# Altium schematic sheet P18 Level Switch.SchDoc
size 420 x 297 mm
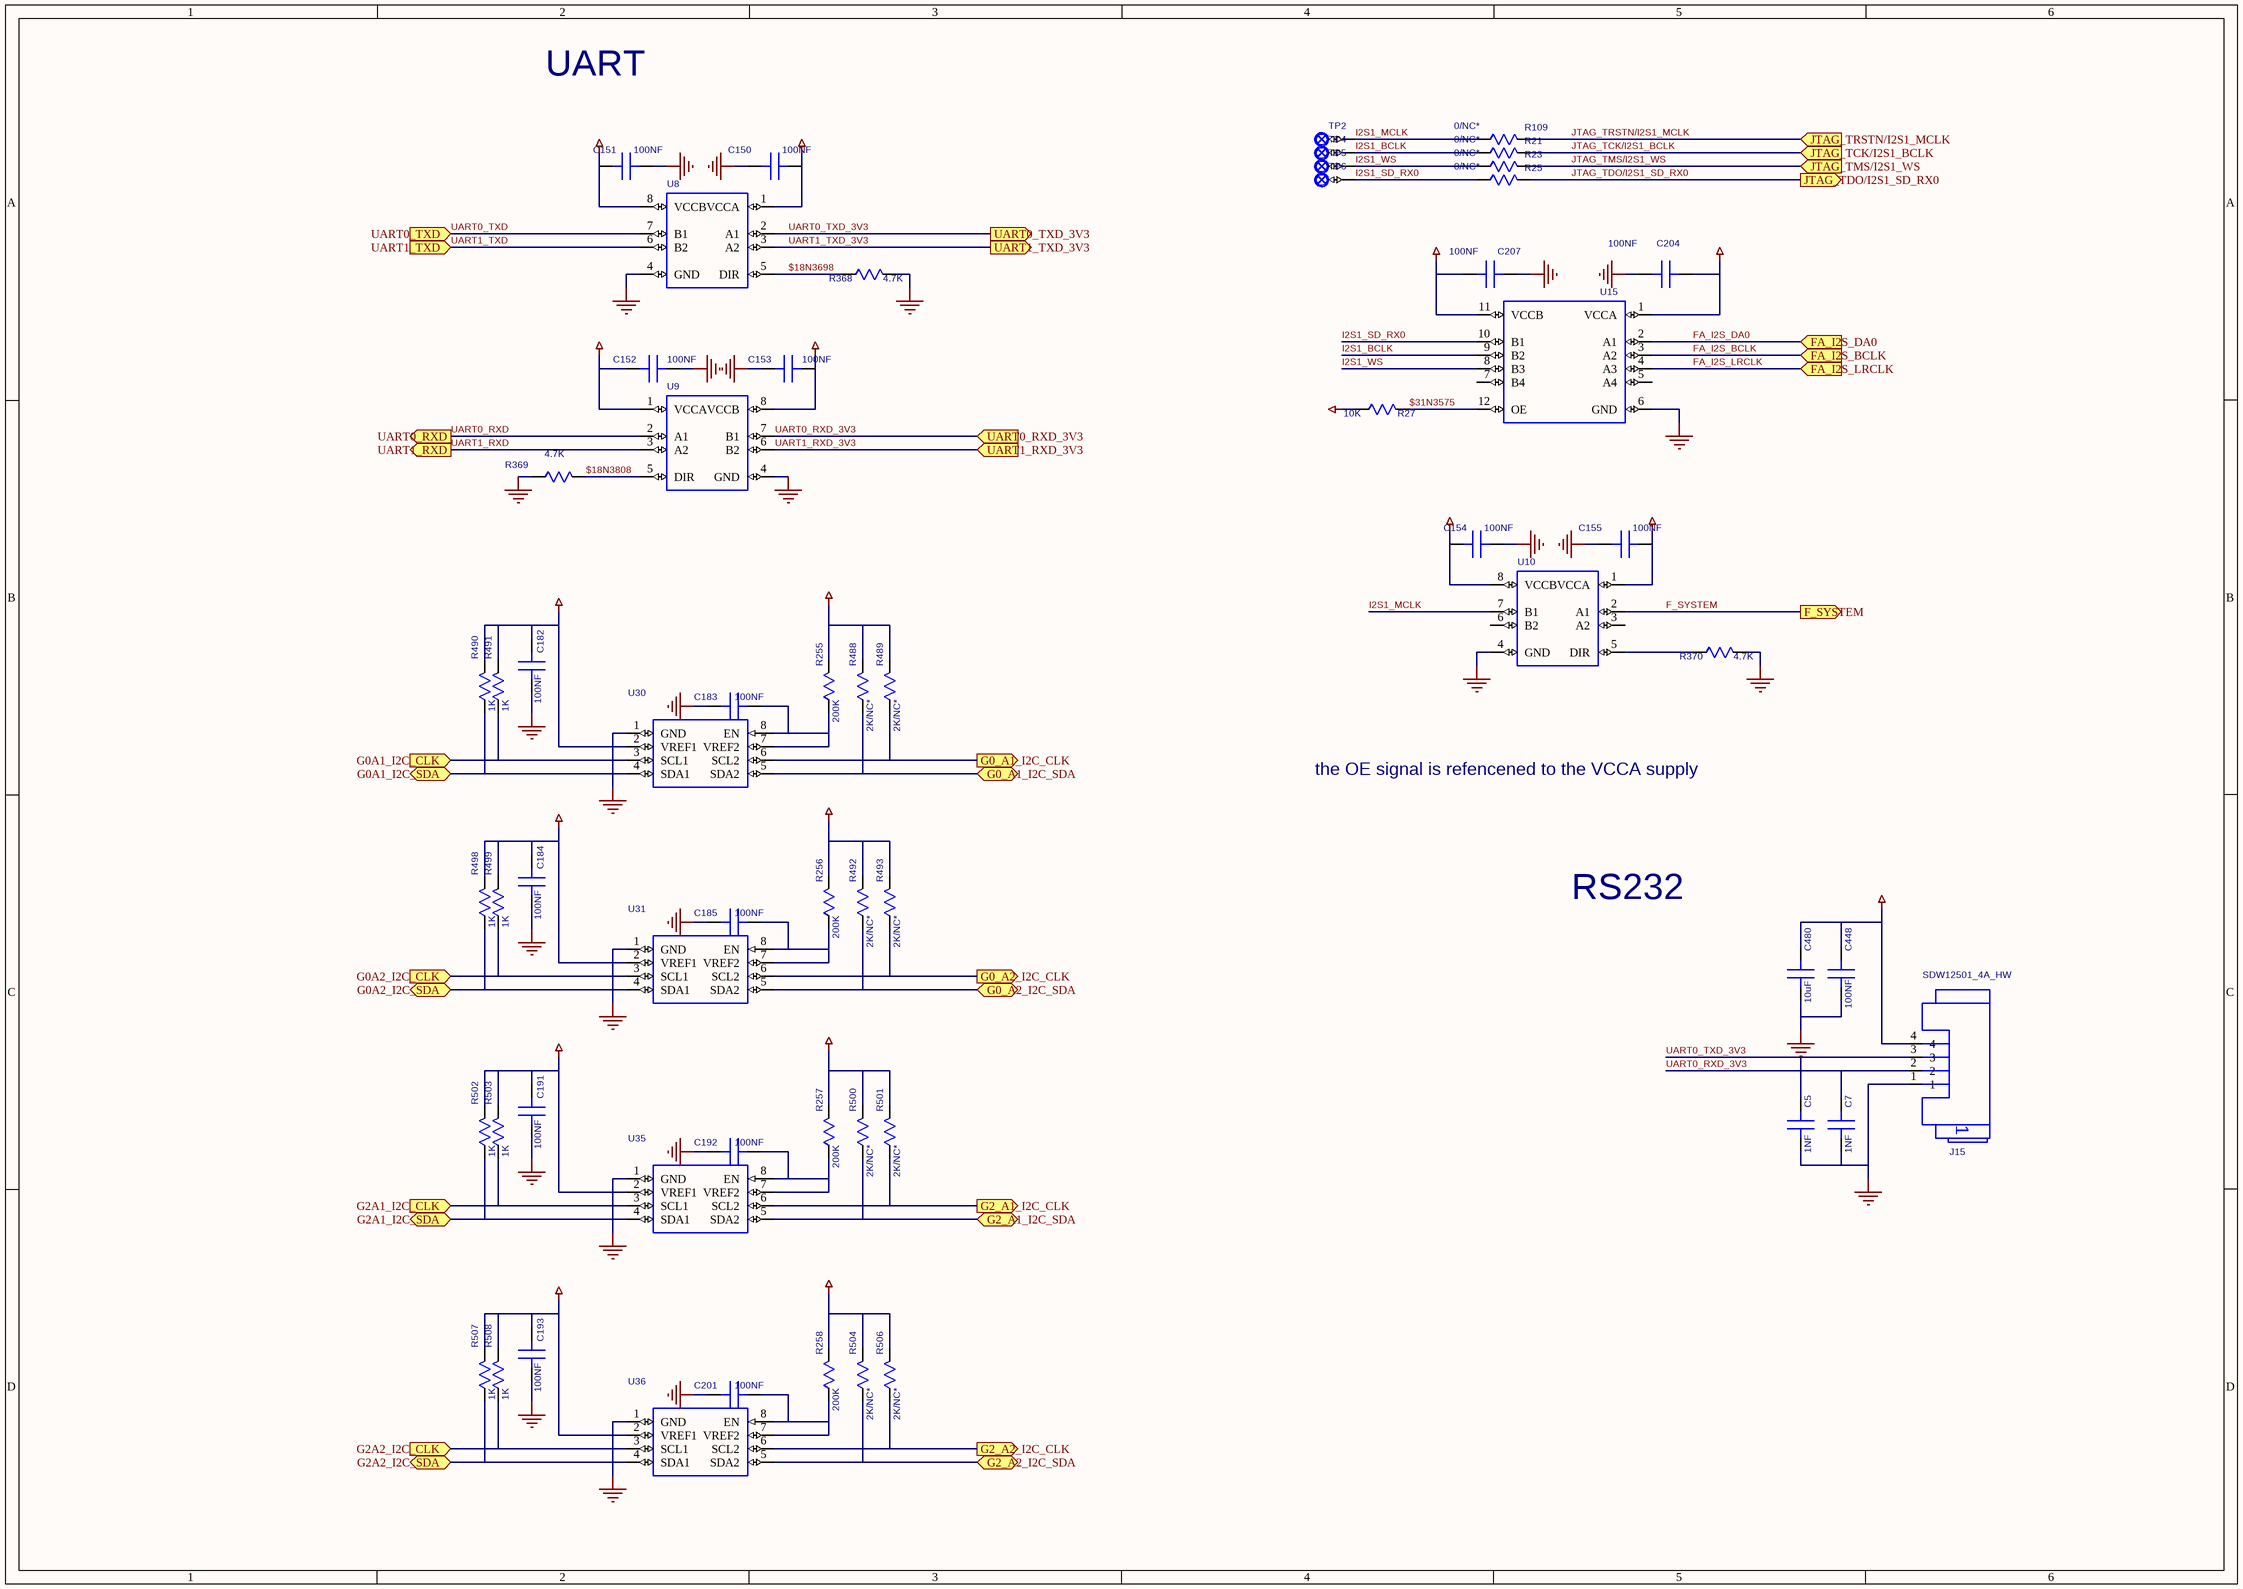
[diagram p0: P18 Level Switch.SchDoc]

## Parts
C5  1NF  [SC0402]
C7  1NF  [SC0402]
C150  100NF  [SC0402]
C151  100NF  [SC0402]
C152  100NF  [SC0402]
C153  100NF  [SC0402]
C154  100NF  [SC0402]
C155  100NF  [SC0402]
C182  100NF  [SC0402]
C183  100NF  [SC0402]
C184  100NF  [SC0402]
C185  100NF  [SC0402]
C191  100NF  [SC0402]
C192  100NF  [SC0402]
C193  100NF  [SC0402]
C201  100NF  [SC0402]
C204  100NF  [SC0402]
C207  100NF  [SC0402]
C448  100NF  [SC0402]
C480  10uF  [SC0603]
J15  DEVICE: SDW12501_4A_HW  [4PIN-254]  (hidden comment: WBC1X41)
R21  0/NC*  [SR0402]
R23  0/NC*  [SR0402]
R25  0/NC*  [SR0402]
R27  10K  [SR0402]
R109  0/NC*  [SR0402]
R255  200K  [SR0402]
R256  200K  [SR0402]
R257  200K  [SR0402]
R258  200K  [SR0402]
R368  4.7K  [SR0402]
R369  4.7K  [SR0402]
R370  4.7K  [SR0402]
R488  2K/NC*  [SR0402]
R489  2K/NC*  [SR0402]
R490  1K  [SR0402]
R491  1K  [SR0402]
R492  2K/NC*  [SR0402]
R493  2K/NC*  [SR0402]
R498  1K  [SR0402]
R499  1K  [SR0402]
R500  2K/NC*  [SR0402]
R501  2K/NC*  [SR0402]
R502  1K  [SR0402]
R503  1K  [SR0402]
R504  2K/NC*  [SR0402]
R506  2K/NC*  [SR0402]
R507  1K  [SR0402]
R508  1K  [SR0402]
TP2  TESTPOINT  [TP24-SMD]  (value not drawn)
TP4  TESTPOINT  [TP24-SMD]  (value not drawn)
TP5  TESTPOINT  [TP24-SMD]  (value not drawn)
TP6  TESTPOINT  [TP24-SMD]  (value not drawn)
U8  SN74AVCH2T45  [SOP8-20-91]  (value not drawn)
U9  SN74AVCH2T45  [SOP8-20-91]  (value not drawn)
U10  SN74AVCH2T45  [SOP8-20-91]  (value not drawn)
U15  TXB0304  [MLF12A-040-0202L]  (value not drawn)
U30  PCA9306DCTT  [SOP8-20-91]  (value not drawn)
U31  PCA9306DCTT  [SOP8-20-91]  (value not drawn)
U35  PCA9306DCTT  [SOP8-20-91]  (value not drawn)
U36  PCA9306DCTT  [SOP8-20-91]  (value not drawn)

## Ports
F_SYSTEM, FA_I2S_BCLK, FA_I2S_DA0, FA_I2S_LRCLK, G0_A1_I2C_CLK, G0_A1_I2C_SDA, G0_A2_I2C_CLK, G0_A2_I2C_SDA, G0A1_I2C_CLK, G0A1_I2C_SDA, G0A2_I2C_CLK, G0A2_I2C_SDA, G2_A1_I2C_CLK, G2_A1_I2C_SDA, G2_A2_I2C_CLK, G2_A2_I2C_SDA, G2A1_I2C_CLK, G2A1_I2C_SDA, G2A2_I2C_CLK, G2A2_I2C_SDA, JTAG_TCK/I2S1_BCLK, JTAG_TDO/I2S1_SD_RX0, JTAG_TMS/I2S1_WS, JTAG_TRSTN/I2S1_MCLK, UART0_RXD, UART0_RXD_3V3, UART0_TXD, UART0_TXD_3V3, UART1_RXD, UART1_RXD_3V3, UART1_TXD, UART1_TXD_3V3

## Nets
1V8: C151.1(A) C152.1(A) C154.1(A) C182.1(A) C184.1(A) C191.1(A) C193.1(A) C207.1(A) R490.1(A) R491.1(A) R498.1(A) R499.1(A) R502.1(A) R503.1(A) R507.1(A) R508.1(A) U8.8(VCCB) U9.1(VCCA) U10.8(VCCB) U15.11(VCCB) U30.2(VREF1) U31.2(VREF1) U35.2(VREF1) U36.2(VREF1)
3V3: C150.1(A) C153.1(A) C155.1(A) C204.1(A) C448.1(A) C480.1(A) J15.4 R27.2(B) R255.1(A) R256.1(A) R257.1(A) R258.1(A) R488.1(A) R489.1(A) R492.1(A) R493.1(A) R500.1(A) R501.1(A) R504.1(A) R506.1(A) U8.1(VCCA) U9.8(VCCB) U10.1(VCCA) U15.1(VCCA)
GND: C5.2(B) C7.2(B) C150.2(B) C151.2(B) C152.2(B) C153.2(B) C154.2(B) C155.2(B) C182.2(B) C183.2(B) C184.2(B) C185.2(B) C191.2(B) C192.2(B) C193.2(B) C201.2(B) C204.2(B) C207.2(B) C448.2(B) C480.2(B) J15.1 R368.2(B) R369.1(A) R370.2(B) U8.4(GND) U9.4(GND) U10.4(GND) U15.6(GND) U30.1(GND) U31.1(GND) U35.1(GND) U36.1(GND)
$18N3698: R368.1(A) U8.5(DIR)
$18N3808: R369.2(B) U9.5(DIR)
$31N3575: R27.1(A) U15.12(OE)
F_SYSTEM: U10.2(A1) ; port F_SYSTEM
FA_I2S_BCLK: U15.3(A2) ; port FA_I2S_BCLK
FA_I2S_DA0: U15.2(A1) ; port FA_I2S_DA0
FA_I2S_LRCLK: U15.4(A3) ; port FA_I2S_LRCLK
G0_A1_I2C_CLK: R489.2(B) U30.6(SCL2) ; port G0_A1_I2C_CLK
G0_A1_I2C_SDA: R488.2(B) U30.5(SDA2) ; port G0_A1_I2C_SDA
G0_A2_I2C_CLK: R493.2(B) U31.6(SCL2) ; port G0_A2_I2C_CLK
G0_A2_I2C_SDA: R492.2(B) U31.5(SDA2) ; port G0_A2_I2C_SDA
G0A1_I2C_CLK: R491.2(B) U30.3(SCL1) ; port G0A1_I2C_CLK
G0A1_I2C_SDA: R490.2(B) U30.4(SDA1) ; port G0A1_I2C_SDA
G0A2_I2C_CLK: R499.2(B) U31.3(SCL1) ; port G0A2_I2C_CLK
G0A2_I2C_SDA: R498.2(B) U31.4(SDA1) ; port G0A2_I2C_SDA
G2_A1_I2C_CLK: R501.2(B) U35.6(SCL2) ; port G2_A1_I2C_CLK
G2_A1_I2C_SDA: R500.2(B) U35.5(SDA2) ; port G2_A1_I2C_SDA
G2_A2_I2C_CLK: R506.2(B) U36.6(SCL2) ; port G2_A2_I2C_CLK
G2_A2_I2C_SDA: R504.2(B) U36.5(SDA2) ; port G2_A2_I2C_SDA
G2A1_I2C_CLK: R503.2(B) U35.3(SCL1) ; port G2A1_I2C_CLK
G2A1_I2C_SDA: R502.2(B) U35.4(SDA1) ; port G2A1_I2C_SDA
G2A2_I2C_CLK: R508.2(B) U36.3(SCL1) ; port G2A2_I2C_CLK
G2A2_I2C_SDA: R507.2(B) U36.4(SDA1) ; port G2A2_I2C_SDA
I2S1_BCLK: R21.2(B) TP4.1 U15.9(B2)
I2S1_MCLK: R109.2(B) TP2.1 U10.7(B1)
I2S1_SD_RX0: R25.2(B) TP6.1 U15.10(B1)
I2S1_WS: R23.2(B) TP5.1 U15.8(B3)
JTAG_TCK/I2S1_BCLK: R21.1(A) ; port JTAG_TCK/I2S1_BCLK
JTAG_TDO/I2S1_SD_RX0: R25.1(A) ; port JTAG_TDO/I2S1_SD_RX0
JTAG_TMS/I2S1_WS: R23.1(A) ; port JTAG_TMS/I2S1_WS
JTAG_TRSTN/I2S1_MCLK: R109.1(A) ; port JTAG_TRSTN/I2S1_MCLK
UART0_RXD: U9.2(A1) ; port UART0_RXD
UART0_RXD_3V3: C7.1(A) J15.2 U9.7(B1) ; port UART0_RXD_3V3
UART0_TXD: U8.7(B1) ; port UART0_TXD
UART0_TXD_3V3: C5.1(A) J15.3 U8.2(A1) ; port UART0_TXD_3V3
UART1_RXD: U9.3(A2) ; port UART1_RXD
UART1_RXD_3V3: U9.6(B2) ; port UART1_RXD_3V3
UART1_TXD: U8.6(B2) ; port UART1_TXD
UART1_TXD_3V3: U8.3(A2) ; port UART1_TXD_3V3
NetC183_1: C183.1(A) R255.2(B) U30.7(VREF2) U30.8(EN)
NetC185_1: C185.1(A) R256.2(B) U31.7(VREF2) U31.8(EN)
NetC192_1: C192.1(A) R257.2(B) U35.7(VREF2) U35.8(EN)
NetC201_1: C201.1(A) R258.2(B) U36.7(VREF2) U36.8(EN)
NetR370_1: R370.1(A) U10.5(DIR)

Not connected (* = marked no-connect by the designer): U10 3(A2) 6(B2); U15 5(A4) 7(B4)

## Notes on the sheet
- UART
- the OE signal is refencened to the VCCA supply
- RS232

## Library data of the parts
C5 = C_0: PARTS: 1; OriginalSymbolOrigin: (0,30); DEVICE: 04025C102KAT2A; LEVEL: STD; PINSWAP: (A,B); %208%%161%%192%%224%%195%%251%%179%%198%: SMD陶瓷电容; COMPONENT_HIGH_MAX: 0.56MM; %182%%238%%182%%168%%185%%164%%215%%247%%181%%231%%209%%185%(V): 50; %195%%232%%202%%246%: SMD陶瓷电容-50V-1NF-+/-10%-X7R-0402-BT; CODE: 8070531; PKG_TYPE: SC0402
C7 = C_0: PARTS: 1; OriginalSymbolOrigin: (0,30); DEVICE: 04025C102KAT2A; LEVEL: STD; PINSWAP: (A,B); CODE: 8070531; %195%%232%%202%%246%: SMD陶瓷电容-50V-1NF-+/-10%-X7R-0402-BT; %182%%238%%182%%168%%185%%164%%215%%247%%181%%231%%209%%185%(V): 50; COMPONENT_HIGH_MAX: 0.56MM; %208%%161%%192%%224%%195%%251%%179%%198%: SMD陶瓷电容; PKG_TYPE: SC0402
C150 C152 C153 C155 C204 = C: PARTS: 1; OriginalSymbolOrigin: (0,0); DEVICE: RMEMK105BJ104KV_FR; LEVEL: STD; PINSWAP: (A,B); %208%%161%%192%%224%%195%%251%%179%%198%: SMD陶瓷电容; COMPONENT_HIGH_MAX: 0.55MM; %182%%238%%182%%168%%185%%164%%215%%247%%181%%231%%209%%185%(V): 16; %195%%232%%202%%246%: SMD陶瓷电容-16V-100nF-+/-10%-X7R-0402-BT; CODE: 8070614; PKG_TYPE: SC0402
C151 C154 C207 = C: PARTS: 1; OriginalSymbolOrigin: (0,0); DEVICE: RMEMK105BJ104KV_FR; LEVEL: STD; PINSWAP: (A,B); CODE: 8070614; %195%%232%%202%%246%: SMD陶瓷电容-16V-100nF-+/-10%-X7R-0402-BT; %182%%238%%182%%168%%185%%164%%215%%247%%181%%231%%209%%185%(V): 16; COMPONENT_HIGH_MAX: 0.55MM; %208%%161%%192%%224%%195%%251%%179%%198%: SMD陶瓷电容; PKG_TYPE: SC0402
C182-C185 C191-C193 C201 = C: PARTS: 1; OriginalSymbolOrigin: (0,0); DEVICE: RMEMK105BJ104KV_FR; LEVEL: STD; PINSWAP: (A,B); COMPONENT_HIGH_MAX: 0.55MM; %182%%238%%182%%168%%185%%164%%215%%247%%181%%231%%209%%185%(V): 16; CODE: 8070614; %195%%232%%202%%246%: SMD陶瓷电容-16V-100NF-+/-10%-X7R-0402-BT; %208%%161%%192%%224%%195%%251%%179%%198%: SMD陶瓷电容; PKG_TYPE: SC0402
C448 = C_0_Dup1: PARTS: 1; PINSWAP: (A,B); LEVEL: STD; DEVICE: RMEMK105BJ104KV_FR; OriginalSymbolOrigin: (0,30); %208%%161%%192%%224%%195%%251%%179%%198%: SMD陶瓷电容; COMPONENT_HIGH_MAX: 0.55MM; %182%%238%%182%%168%%185%%164%%215%%247%%181%%231%%209%%185%(V): 16; %195%%232%%202%%246%: SMD陶瓷电容-16V-100NF-+/-10%-X7R-0402-BT; CODE: 8070614; PKG_TYPE: SC0402
C480 = C_0_Dup1: PARTS: 1; PINSWAP: (A,B); LEVEL: STD; DEVICE: C1608X5R0J106MT0A0E; OriginalSymbolOrigin: (0,30); %208%%161%%192%%224%%195%%251%%179%%198%: SMD陶瓷电容; COMPONENT_HIGH_MAX: 0.9MM; %182%%238%%182%%168%%185%%164%%215%%247%%181%%231%%209%%185%(V): 6.3; %195%%232%%202%%246%: SMD陶瓷电容-6.3V-10000NF-+/-20%-X5R-0603-BT,TS16949; CODE: 8070649; PKG_TYPE: SC0603
J15 = WBC1X41_0: PARTS: 1; OriginalSymbolOrigin: (10,130); CODE: 14100167; PKG_TYPE: WBC0104-49T; LEVEL: STD; %195%%232%%202%%246%: 普通插座-4PIN-单排-直式-1.25MM-2MM-THT-1A; COMPONENT_HIGH_MAX: 4.2MM; %208%%161%%192%%224%%195%%251%%179%%198%: 普通插座
R21 = R_Dup1: PARTS: 1; OriginalSymbolOrigin: (0,0); PINSWAP: (A,B); DEVICE: RC0402JR_070R; LEVEL: STD; VARIANT_ID: $10I3470; %208%%161%%192%%224%%195%%251%%179%%198%: 片式厚膜电阻器; %195%%232%%202%%246%: 片式厚膜电阻器-0.0625W-0ohm-< 50mohm-0402-1A-BT; CODE: 7090800; COMPONENT_HIGH_MAX: 0.4MM; PKG_TYPE: SR0402
R23 = R_Dup1: PARTS: 1; OriginalSymbolOrigin: (0,0); PINSWAP: (A,B); DEVICE: RC0402JR_070R; LEVEL: STD; VARIANT_ID: $10I3506; COMPONENT_HIGH_MAX: 0.4MM; CODE: 7090800; %195%%232%%202%%246%: 片式厚膜电阻器-0.0625W-0ohm-< 50mohm-0402-1A-BT; %208%%161%%192%%224%%195%%251%%179%%198%: 片式厚膜电阻器; PKG_TYPE: SR0402
R25 = R_Dup1: PARTS: 1; OriginalSymbolOrigin: (0,0); PINSWAP: (A,B); DEVICE: RC0402JR_070R; LEVEL: STD; COMPONENT_HIGH_MAX: 0.4MM; CODE: 7090800; %195%%232%%202%%246%: 片式厚膜电阻器-0.0625W-0ohm-< 50mohm-0402-1A-BT; %208%%161%%192%%224%%195%%251%%179%%198%: 片式厚膜电阻器; VARIANT_ID: $10I3539; PKG_TYPE: SR0402
R27 = R_Dup1: PARTS: 1; OriginalSymbolOrigin: (0,0); PINSWAP: (A,B); DEVICE: RC_02W103JT; LEVEL: STD; CODE: 7090815; %195%%232%%202%%246%: 片式厚膜电阻器-0.0625W-10000ohm-+/-5%-0402-BT; %182%%238%%182%%168%%185%%166%%194%%202%(W): 0.06; %215%%232%%214%%181%%212%%202%%208%%237%%198%%171%%178%%238%: +/-5%; COMPONENT_HIGH_MAX: 0.4MM; %208%%161%%192%%224%%195%%251%%179%%198%: 片式厚膜电阻器; PKG_TYPE: SR0402
R109 = R_Dup1: PARTS: 1; OriginalSymbolOrigin: (0,0); PINSWAP: (A,B); DEVICE: RC0402JR_070R; LEVEL: STD; VARIANT_ID: $10I3071; COMPONENT_HIGH_MAX: 0.4MM; CODE: 7090800; %195%%232%%202%%246%: 片式厚膜电阻器-0.0625W-0ohm-< 50mohm-0402-1A-BT; %208%%161%%192%%224%%195%%251%%179%%198%: 片式厚膜电阻器; PKG_TYPE: SR0402
R255-R258 = R_Dup1: PARTS: 1; OriginalSymbolOrigin: (0,0); PINSWAP: (A,B); DEVICE: RC0402FR_07200KL; LEVEL: STD; %208%%161%%192%%224%%195%%251%%179%%198%: 片式厚膜电阻器; COMPONENT_HIGH_MAX: 0.4MM; %195%%232%%202%%246%: 片式厚膜电阻器-0.0625W-200000ohm-+/- 1%-0402-供电专用-供电专用; CODE: 7091442; PKG_TYPE: SR0402
R368-R370 = R_Dup1: PARTS: 1; OriginalSymbolOrigin: (0,0); PINSWAP: (A,B); DEVICE: RK73B1ELTP472J; LEVEL: STD; COMPONENT_HIGH_MAX: 0.4MM; CODE: 7090793; %195%%232%%202%%246%: 片式厚膜电阻器-0.0625W-4700ohm-+/-5%-0402-BT; %208%%161%%192%%224%%195%%251%%179%%198%: 片式厚膜电阻器; PKG_TYPE: SR0402
R488 R492 R500 R504 = R_Dup1: PARTS: 1; OriginalSymbolOrigin: (0,0); PINSWAP: (A,B); DEVICE: RC0402FR_072KL; LEVEL: STD; VARIANT_ID: $24I1308; CODE: 7091529; %195%%232%%202%%246%: 片式厚膜电阻器-0.0625W-2000ohm-+/-1%-0402--供电专用-07091354-供电专用; COMPONENT_HIGH_MAX: 0.32MM; %208%%161%%192%%224%%195%%251%%179%%198%: 片式厚膜电阻器; PKG_TYPE: SR0402
R489 R493 R501 R506 = R_Dup1: PARTS: 1; OriginalSymbolOrigin: (0,0); PINSWAP: (A,B); DEVICE: RC0402FR_072KL; LEVEL: STD; VARIANT_ID: $24I1307; %208%%161%%192%%224%%195%%251%%179%%198%: 片式厚膜电阻器; COMPONENT_HIGH_MAX: 0.32MM; %195%%232%%202%%246%: 片式厚膜电阻器-0.0625W-2000ohm-+/-1%-0402--供电专用-07091354-供电专用; CODE: 7091529; PKG_TYPE: SR0402
R490 R491 R498 R499 R502 R503 R507 R508 = R_Dup1: PARTS: 1; OriginalSymbolOrigin: (0,0); PINSWAP: (A,B); DEVICE: RC0402FR_072KL; LEVEL: STD; CODE: 7091529; %195%%232%%202%%246%: 片式厚膜电阻器-0.0625W-2000ohm-+/-1%-0402--供电专用-07091354-供电专用; COMPONENT_HIGH_MAX: 0.32MM; %208%%161%%192%%224%%195%%251%%179%%198%: 片式厚膜电阻器; PKG_TYPE: SR0402
TP2 TP4-TP6 = TESTPOINT: PARTS: 1; OriginalSymbolOrigin: (0,0); LEVEL: STD; DEVICE: TEST-SMD; PKG_TYPE: TP24-SMD
U8 U10 = SN74AVCH2T45_0: PARTS: 1; OriginalSymbolOrigin: (0,0); CODE: 36020376; LEVEL: STD; DEVICE: 74AVCH2T45DC; %208%%161%%192%%224%%195%%251%%179%%198%: CMOS; COMPONENT_HIGH_MAX: 0.9MM; %195%%232%%202%%246%: CMOS-DUAL-BIT DUAL-SUPPLY BUS TRANSCEIVER-VSSOP-3ns-12mA-CMOS-CMOS; PKG_TYPE: SOP8-20-91
U9 = SN74AVCH2T45_0: PARTS: 1; OriginalSymbolOrigin: (0,0); CODE: 36020376; LEVEL: STD; DEVICE: 74AVCH2T45DC; %195%%232%%202%%246%: CMOS-DUAL-BIT DUAL-SUPPLY BUS TRANSCEIVER-VSSOP-3ns-12mA-CMOS-CMOS; COMPONENT_HIGH_MAX: 0.9MM; %208%%161%%192%%224%%195%%251%%179%%198%: CMOS; PKG_TYPE: SOP8-20-91
U15 = TXB0304: PARTS: 1; OriginalSymbolOrigin: (0,0); LEVEL: STD; DEVICE: NLSX5014MUTAG; CODE: 36020404; %195%%232%%202%%246%: LVCMOS-4BIT自动方向识别电平转换芯片-QFN12-13.5ns-50mA-CMOS-CMOS-0ns-0ns-0ns; COMPONENT_HIGH_MAX: 0.55MM; %208%%161%%192%%224%%195%%251%%179%%198%: LVCMOS; PKG_TYPE: MLF12A-040-0202L
U30 U31 U35 U36 = PCA9306DCTT: PARTS: 1; OriginalSymbolOrigin: (0,0); LEVEL: STD; DEVICE: PCA9306DC1_A; CODE: 43140147; %195%%232%%202%%246%: 接口控制器-I2C电平转换器-Vref(1):1.2V~3.3V/Vref(2):1.8V~5.5V-VSSOP8; COMPONENT_HIGH_MAX: 1MM; PKG_TYPE: SOP8-50-150; %208%%161%%192%%224%%195%%251%%179%%198%: 接口控制器